# Altium schematic sheet Stepper.SchDoc
size A4
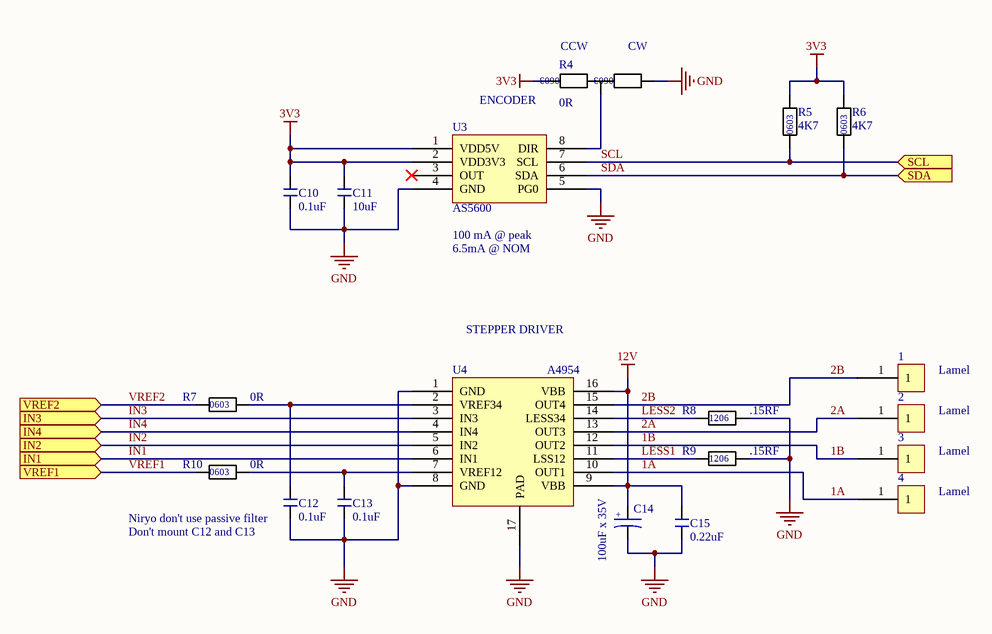
[diagram p0: Stepper.SchDoc]

## Parts
1  Lamel  [LAMEL]
2  Lamel  [LAMEL]
3  Lamel  [LAMEL]
4  Lamel  [LAMEL]
C10  0.1uF  [CHIP_C_0603]
C11  10uF  [CHIP_C_0603]
C12  0.1uF  [CHIP_C_0603]
C13  0.1uF  [CHIP_C_0603]
C14  100uF x 35V  [ALUM_CAP_D]
C15  0.22uF  [CHIP_C_0603]
R4  0R  [0R 0603 selector]
R5  4K7  [CHIP_R_0603]
R6  4K7  [CHIP_R_0603]
R7  0R  [CHIP_R_0603]
R8  .15RF  [CHIP_R_1206]
R9  .15RF  [CHIP_R_1206]
R10  0R  [CHIP_R_0603]
U3  AS5600  [SOIC8]
U4  A4954  [TSSOP-16P]

## Ports
IN1 (in), IN2 (in), IN3 (in), IN4 (in), SCL (in), SDA (in), VREF1 (in), VREF2 (in)

## Nets
3V3: C10.2 C11.2 R4.1 R5.2 R6.2 U3.1(VDD5V) U3.2(VDD3V3)
12V: C14.2 C15.2 U4.9(VBB) U4.16(VBB)
GND: C10.1 C11.1 C12.1 C13.1 C14.1 C15.1 R4.3 R8.2 R9.2 U3.4(GND) U3.5(PG0) U4.1(GND) U4.8(GND) U4.17(PAD)
1A: 4.1 U4.10(OUT1)
1B: 3.1 U4.12(OUT2)
2A: 2.1 U4.13(OUT3)
2B: 1.1 U4.15(OUT4)
IN1: U4.6(IN1) ; port IN1
IN2: U4.5(IN2) ; port IN2
IN3: U4.3(IN3) ; port IN3
IN4: U4.4(IN4) ; port IN4
LESS1: R9.1 U4.11(LSS12)
LESS2: R8.1 U4.14(LESS34)
SCL: R5.1 U3.7(SCL) ; port SCL
SDA: R6.1 U3.6(SDA) ; port SDA
VREF1: R10.1 ; port VREF1
VREF2: R7.1 ; port VREF2
NetC12_2: C12.2 R7.2 U4.2(VREF34)
NetC13_2: C13.2 R10.2 U4.7(VREF12)
NetR4_2: R4.2 U3.8(DIR)

Not connected (* = marked no-connect by the designer): U3 3(OUT)*

## Notes on the sheet
- (near R4) CCW
- (near R4) CW
- ENCODER
- (near U3) 100 mA @ peak
- 6.5mA @ NOM
- STEPPER DRIVER
- (near C12) Niryo don't use passive filter
- (near C12) Don't mount C12 and C13
- (in symbol Electrolit) +
- (in symbol RES_0603) 0603
- (in symbol RES_1206) 1206
- (in symbol Selector_0603) 0603

## Library data of the parts
C10-C13 C15 = CHIP_C
C14 = Electrolit
R4 = Selector_0603
R5-R7 R10 = RES_0603
R8 R9 = RES_1206: Resistor
U3 = AS5600: program magnetic rotary position  sensor
U4 = A4954: DMOS PWM Motor Driver